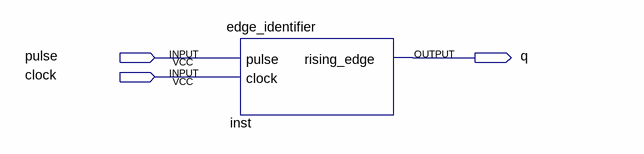
[diagram p0: schematic sheet]
// Quartus schematic edge_identifier_test.bdf as structural Verilog: 1 symbols, 3 pins
module edge_identifier_test (
  input  pulse,
  input  clock,
  output q
);

  edge_identifier inst (.pulse(pulse), .clock(clock), .rising_edge(q));
endmodule
